# EAGLE schematic tick-mk-4.7 (EAGLE 6.5.0)
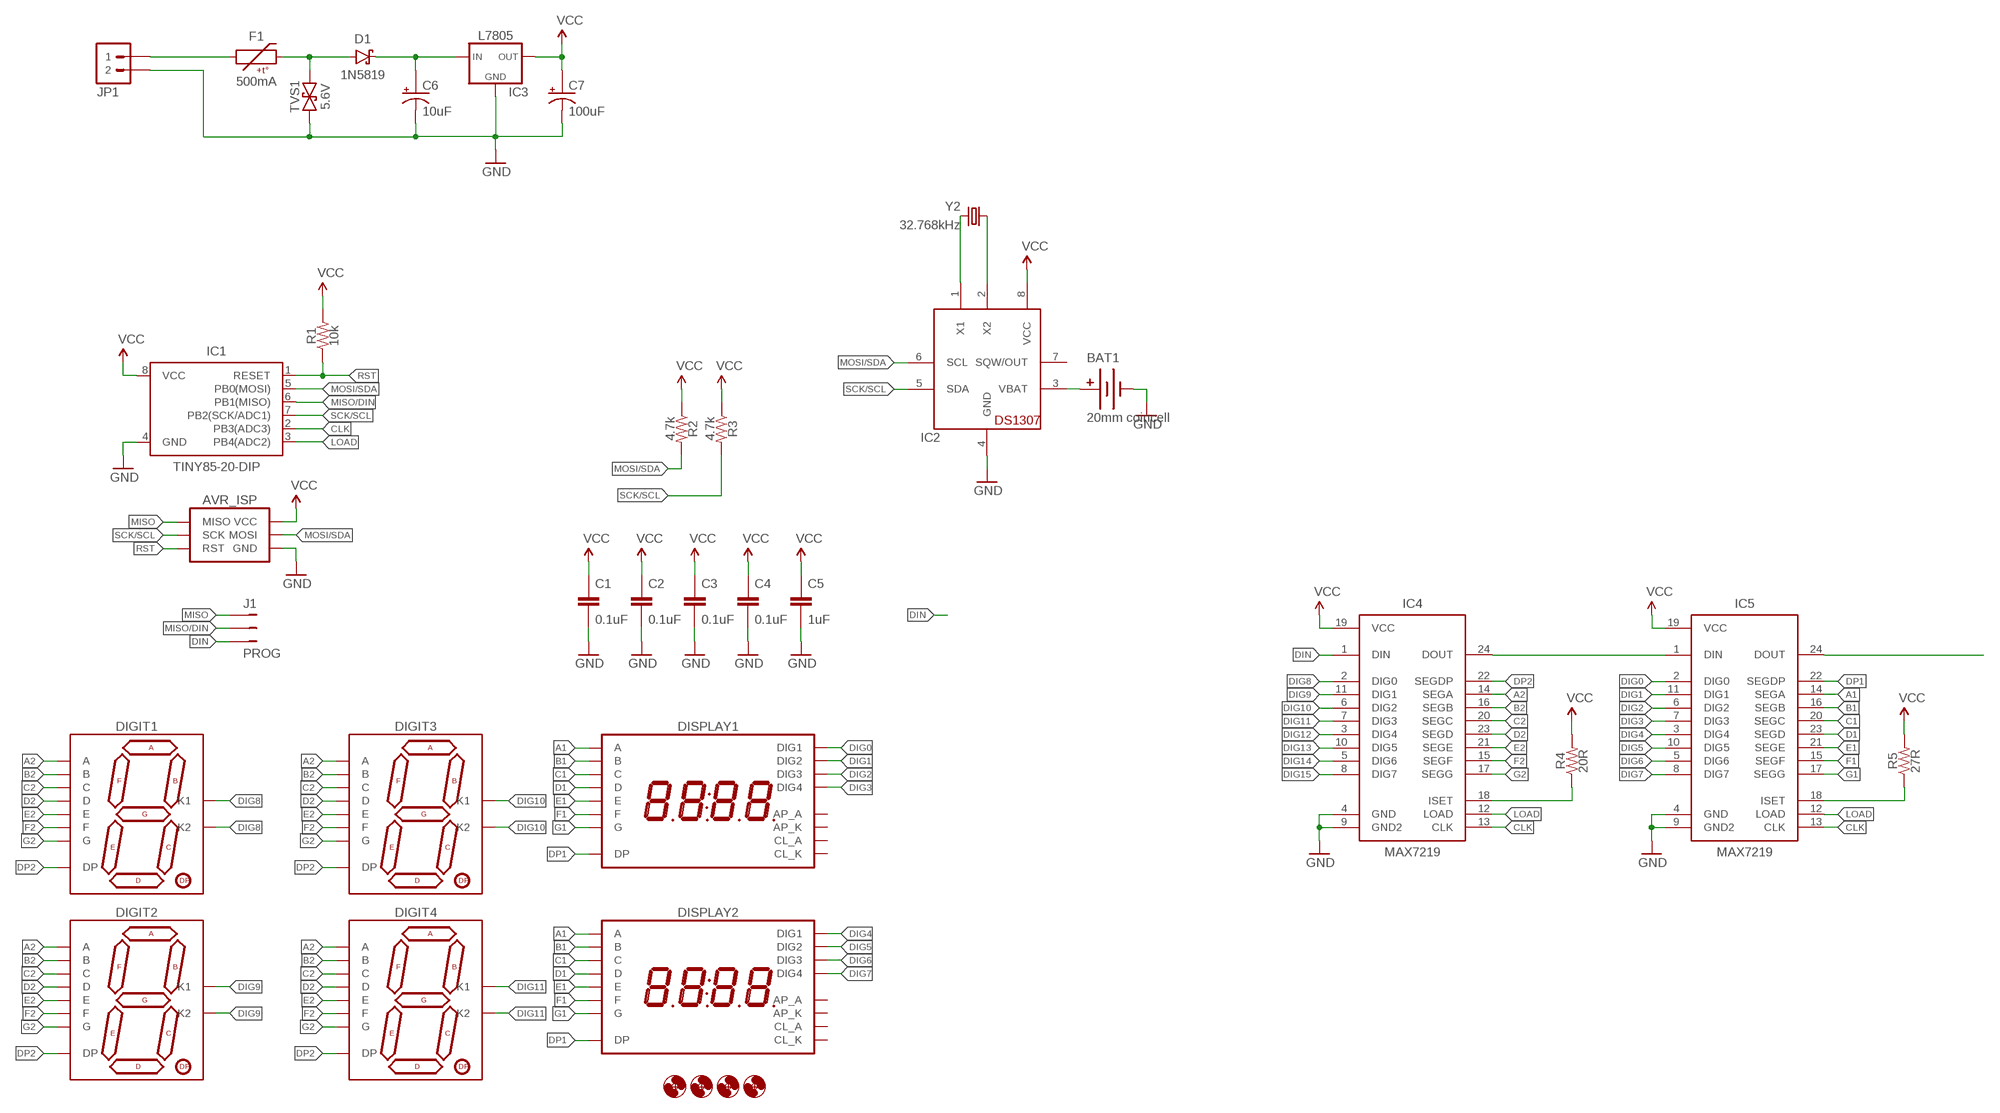
[diagram p0: schematic, sheet 1]

## Parts
AVR_ISP  AVR_SPI_PRG_6PTH  [2X3]
BAT1  20mm coincell  BATTERY20MMSMD-MINE  [BATTCON_20MM_MINE]
C1  0.1uF  CAPACITOR-CERAMIC025-024X044  [C025-024X044]
C2  0.1uF  CAPACITOR-CERAMIC025-024X044  [C025-024X044]
C3  0.1uF  CAPACITOR-CERAMIC025-024X044  [C025-024X044]
C4  0.1uF  CAPACITOR-CERAMIC025-024X044  [C025-024X044]
C5  1uF  CAPACITOR-CERAMIC025-024X044  [C025-024X044]
C6  10uF  CAPACITOR-POLARIZEDE2-5  [E2-5]
C7  100uF  CAPACITOR-POLARIZEDE2.5-6  [E2,5-6]
D1  1N5819  DIODE-SCHOTTKYPTH-10.16MM  [DIODE-10.16MM]
DIGIT1  7SEG_1DIGPTH-25.4MM-BARE  [7SEG_1DIG_25.4MM_NOSILK]
DIGIT2  7SEG_1DIGPTH-25.4MM-BARE  [7SEG_1DIG_25.4MM_NOSILK]
DIGIT3  7SEG_1DIGPTH-25.4MM-BARE  [7SEG_1DIG_25.4MM_NOSILK]
DIGIT4  7SEG_1DIGPTH-25.4MM-BARE  [7SEG_1DIG_25.4MM_NOSILK]
DISPLAY1  7SEG_4DIGIT_COLON_APOS  [7SEG_4DIG_10MM]
DISPLAY2  7SEG_4DIGIT_COLON_APOS  [7SEG_4DIG_10MM]
F1  500mA  PTCPTH-5.08MM  [PTC-PTH-5.08MM]
H1  HOLE#2  [HOLE-#2]
H2  HOLE#2  [HOLE-#2]
H3  HOLE#2  [HOLE-#2]
H4  HOLE#2  [HOLE-#2]
IC1  TINY85-20-DIP  ATTINY45TINY85-20-DIP  [DIP08]
IC2  DS1307  [DIL08]
IC3  L7805  V_REG_78XXTO-220-THERMPAD  [TO220-IGO-THERMPAD]
IC4  MAX7219  MAX7219SOIC-W  [SO24W]
IC5  MAX7219  MAX7219SOIC-W  [SO24W]
J1  PROG  JUMPER-PTH-3-NO  [1X03]
JP1  M02JST-XH-VERT  [JST-2-XH-VERT-PTH]
R1  10k  RESISTORPTH-AXIAL-7.62MM  [RESISTOR-AXIAL-PTH-7.62MM]
R2  4.7k  RESISTORPTH-AXIAL-7.62MM  [RESISTOR-AXIAL-PTH-7.62MM]
R3  4.7k  RESISTORPTH-AXIAL-7.62MM  [RESISTOR-AXIAL-PTH-7.62MM]
R4  20R  RESISTORPTH-AXIAL-7.62MM  [RESISTOR-AXIAL-PTH-7.62MM]
R5  27R  RESISTORPTH-AXIAL-7.62MM  [RESISTOR-AXIAL-PTH-7.62MM]
TVS1  5.6V  TVSDO-41-10.16MM  [DO-41-TVS-BI-10.16MM]
Y2  32.768kHz  CRYSTALTC26H  [TC26H]

## Nets
A1: DISPLAY1.14(A) DISPLAY2.14(A) IC5.14(SEGA)
A2: DIGIT1.7(A) DIGIT2.7(A) DIGIT3.7(A) DIGIT4.7(A) IC4.14(SEGA)
B1: DISPLAY1.16(B) DISPLAY2.16(B) IC5.16(SEGB)
B2: DIGIT1.6(B) DIGIT2.6(B) DIGIT3.6(B) DIGIT4.6(B) IC4.16(SEGB)
C1: DISPLAY1.13(C) DISPLAY2.13(C) IC5.20(SEGC)
C2: DIGIT1.4(C) DIGIT2.4(C) DIGIT3.4(C) DIGIT4.4(C) IC4.20(SEGC)
CLK: IC1.2(PB3(ADC3)) IC4.13(CLK) IC5.13(CLK)
D1: DISPLAY1.3(D) DISPLAY2.3(D) IC5.23(SEGD)
D2: DIGIT1.2(D) DIGIT2.2(D) DIGIT3.2(D) DIGIT4.2(D) IC4.23(SEGD)
DIG0: DISPLAY1.1(DIG1) IC5.2(DIG0)
DIG1: DISPLAY1.2(DIG2) IC5.11(DIG1)
DIG2: DISPLAY1.6(DIG3) IC5.6(DIG2)
DIG3: DISPLAY1.8(DIG4) IC5.7(DIG3)
DIG4: DISPLAY2.1(DIG1) IC5.3(DIG4)
DIG5: DISPLAY2.2(DIG2) IC5.10(DIG5)
DIG6: DISPLAY2.6(DIG3) IC5.5(DIG6)
DIG7: DISPLAY2.8(DIG4) IC5.8(DIG7)
DIG8: DIGIT1.3(K1) DIGIT1.8(K2) IC4.2(DIG0)
DIG9: DIGIT2.3(K1) DIGIT2.8(K2) IC4.11(DIG1)
DIG10: DIGIT3.3(K1) DIGIT3.8(K2) IC4.6(DIG2)
DIG11: DIGIT4.3(K1) DIGIT4.8(K2) IC4.7(DIG3)
DIG12: IC4.3(DIG4)
DIG13: IC4.10(DIG5)
DIG14: IC4.5(DIG6)
DIG15: IC4.8(DIG7)
DIN: IC4.1(DIN) J1.3
DP1: DISPLAY1.7(DP) DISPLAY2.7(DP) IC5.22(SEGDP)
DP2: DIGIT1.5(DP) DIGIT2.5(DP) DIGIT3.5(DP) DIGIT4.5(DP) IC4.22(SEGDP)
E1: DISPLAY1.5(E) DISPLAY2.5(E) IC5.21(SEGE)
E2: DIGIT1.1(E) DIGIT2.1(E) DIGIT3.1(E) DIGIT4.1(E) IC4.21(SEGE)
F1: DISPLAY1.11(F) DISPLAY2.11(F) IC5.15(SEGF)
F2: DIGIT1.9(F) DIGIT2.9(F) DIGIT3.9(F) DIGIT4.9(F) IC4.15(SEGF)
G1: DISPLAY1.15(G) DISPLAY2.15(G) IC5.17(SEGG)
G2: DIGIT1.10(G) DIGIT2.10(G) DIGIT3.10(G) DIGIT4.10(G) IC4.17(SEGG)
GND: AVR_ISP.6(GND) BAT1.BOTTOM(-) C1.2 C2.2 C3.2 C4.2 C5.2 C6.- C7.- IC1.4(GND) IC2.4(GND) IC3.4(GND) IC3.GND IC4.4(GND) IC4.9(GND2) IC5.4(GND) IC5.9(GND2) JP1.2 TVS1.P$1
LOAD: IC1.3(PB4(ADC2)) IC4.12(LOAD) IC5.12(LOAD)
MISO: AVR_ISP.1(MISO) J1.1
MISO/DIN: IC1.6(PB1(MISO)) J1.2
MOSI/SDA: AVR_ISP.4(MOSI) IC1.5(PB0(MOSI)) IC2.6(SCL) R2.P$2
N$1: BAT1.TOP@1(+) BAT1.TOP@2(+) IC2.3(VBAT)
N$2: IC2.1(X1) Y2.2
N$3: IC2.2(X2) Y2.1
N$4: D1.A F1.P$2 TVS1.P$2
N$6: IC5.24(DOUT)
N$7: F1.P$1 JP1.1
N$8: C6.+ D1.C IC3.IN
N$9: IC4.24(DOUT) IC5.1(DIN)
N$11: IC5.18(ISET) R5.P$1
N$12: IC4.18(ISET) R4.P$1
RST: AVR_ISP.5(RST) IC1.1(RESET) R1.P$1
SCK/SCL: AVR_ISP.3(SCK) IC1.7(PB2(SCK/ADC1)) IC2.5(SDA) R3.P$2
VCC: AVR_ISP.2(VCC) C1.1 C2.1 C3.1 C4.1 C5.1 C7.+ IC1.8(VCC) IC2.8(VCC) IC3.OUT IC4.19(VCC) IC5.19(VCC) R1.P$2 R2.P$1 R3.P$1 R4.P$2 R5.P$2
Unconnected: DISPLAY1.4(CL_A) DISPLAY1.9(AP_K) DISPLAY1.10(AP_A) DISPLAY1.12(CL_K) DISPLAY2.4(CL_A) DISPLAY2.9(AP_K) DISPLAY2.10(AP_A) DISPLAY2.12(CL_K) IC2.7(SQW/OUT)

## Library data of the parts
AVR_ISP = A_butts:AVR_SPI_PRG_6: AVR ISP 6 Pin This is the reduced ISP connector for AVR programming. Common on Arduino. This footprint will take up less PCB space and can be used with a 10-pin to 6-pin adapter such as SKU: BOB-08508 **Special note about "TEST_POINT" package. The stop mask is on the top side, so if you want your programming test points to be on the bottom of your board, make sure to place this package on the bottom side of the board. This also ensure that the orientation to program from the bottom side will be correct.
BAT1 = A_butts:BATTERY: Battery Holders Various common sizes : AA, AAA, 20mm coin cell and 12mm coin cell. 20MM_4LEGS, BATT-10373
C1-C5 = A_butts:CAPACITOR-CERAMIC: CAPACITOR, European symbol
C6 C7 = A_butts:CAPACITOR-POLARIZED: POLARIZED CAPACITOR, American symbol
D1 = A_butts:DIODE-SCHOTTKY: Schottky diodes in SFE's production catalog BAT20J 1A 23V 0.62Vf RB751 120mA 40V 0.37Vf PMEG4005EJ 0.5A 40V 0.42Vf MBRA140 1A 40V 0.5Vf B340A 3A 40V SMA
DIGIT1-DIGIT4 = A_butts:7SEG_1DIG
DISPLAY1 DISPLAY2 = A_butts:7SEG_4DIGIT_COLON_APOS
F1 = A_butts:PTC: Resettable Fuse PTC Resettable Fuse. Spark Fun Electronics SKU : COM-08357
H1-H4 = A_butts:HOLE: MOUNTING HOLE with drill center marker
IC1 = A_butts:ATTINY45: Atmel 8-pin 2/4/8kB flash uC; PROD_ID: IC-09445
IC2 = A_butts:DS1307: DS1307 Real time clock (RTC) with battery backup ability. Talk to it via i2c
IC3 = A_butts:V_REG_78XX: Voltage Regulator Standard 7805 5V regulator. IGO (Input Ground Output). Spark Fun Electronics SKU : COM-00107
IC4 IC5 = A_butts:MAX7219: 8-digit, 8-segment LED display driver, serial input
J1 = A_butts:JUMPER-PTH-3-NO
JP1 = A_butts:M02: Standard 2-pin 0.1" header. Use with - straight break away headers ( PRT-00116) - right angle break away headers (PRT-00553) - swiss pins (PRT-00743) - machine pins (PRT-00117) - female headers (PRT-00115) Molex polarized connector foot print use with: PRT-08233 with associated crimp pins and housings. 2.54_SCREWTERM for use with PRT-10571. 3.5mm Screw Terminal footprints for PRT-08084 5mm Screw Terminal footprints for use with PRT-08433
R1-R5 = A_butts:RESISTOR: RESISTOR, American symbol
TVS1 = A_butts:TVS: Transient voltage suppressor- prevents ESD on inputs. Ignore package description- MBRA140 is NOT this type of part!!!
Y2 = A_butts:CRYSTAL: Various standard crystals. Proven footprints. Spark Fun Electronics SKU : COM-00534